# Altium schematic sheet tourellesCommande.SchDoc: Commande
size A4
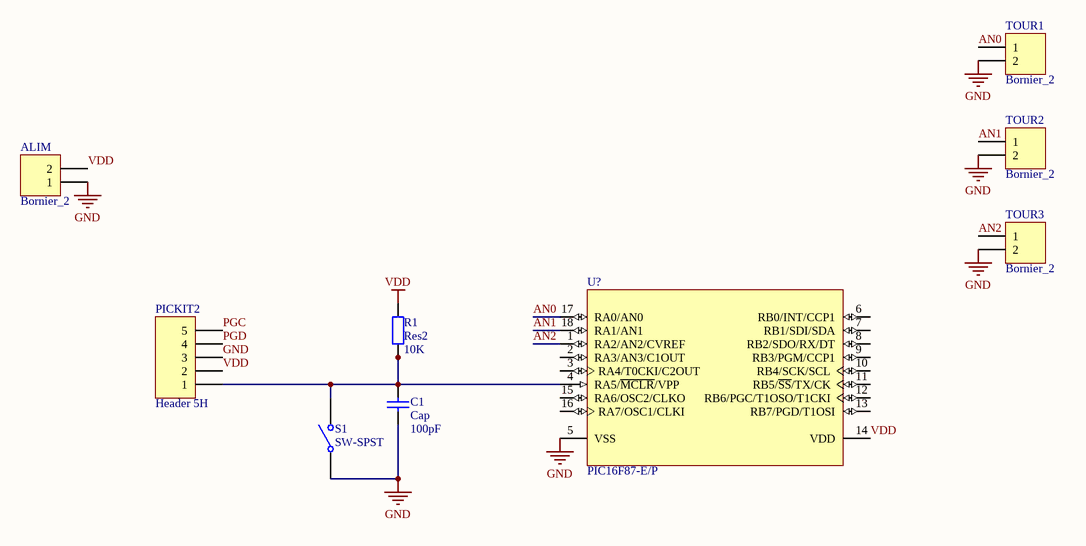
[diagram p0: tourellesCommande.SchDoc]

## Parts
ALIM  Bornier_2  [Bornier_2]
C1  Cap  value 100pF  [RAD-0.3]
PICKIT2  Header 5H  [HDR1X5]
R1  Res2  value 10K  [AXIAL-0.4]
S1  SW-SPST  [SPST-2]
TOUR1  Bornier_2  [Bornier_2]
TOUR2  Bornier_2  [Bornier_2]
TOUR3  Bornier_2  [Bornier_2]
U?  PIC16F87-E/P  [PDIP300-18]

## Nets
GND: ALIM.1 C1.1 PICKIT2.3 S1.1(COMMON) TOUR1.2 TOUR2.2 TOUR3.2 U?.5(VSS)
VDD: ALIM.2 PICKIT2.2 R1.2 U?.14(VDD)
AN0: TOUR1.1 U?.17(RA0/AN0)
AN1: TOUR2.1 U?.18(RA1/AN1)
AN2: TOUR3.1 U?.1(RA2/AN2/CVREF)
PGC: PICKIT2.5
PGD: PICKIT2.4
NetC1_2: C1.2 PICKIT2.1 R1.1 S1.2(NO) U?.4(RA5/~{MCLR}/VPP)

Not connected (* = marked no-connect by the designer): U? 2(RA3/AN3/C1OUT) 3(RA4/T0CKI/C2OUT) 6(RB0/INT/CCP1) 7(RB1/SDI/SDA) 8(RB2/SDO/RX/DT) 9(RB3/PGM/CCP1) 10(RB4/SCK/SCL) 11(RB5/~{SS}/TX/CK) 12(RB6/PGC/T1OSO/T1CKI) 13(RB7/PGD/T1OSI) 15(RA6/OSC2/CLKO) 16(RA7/OSC1/CLKI)

## Notes on the sheet
- Title :
- Size:
- A4
- Date:
- Time:
- File:

## Library data of the parts
ALIM TOUR1-TOUR3 = Bornier_2: Header, 2-Pin; LatestRevisionDate: 17-Jul-2002; LatestRevisionNote: Re-released for DXP Platform.; Publisher: Altium Limited
C1 = Cap: Capacitor; Published: 8-Jun-2000; LatestRevisionDate: 17-Jul-2002; LatestRevisionNote: Re-released for DXP Platform.; PackageReference: RAD-0.3; Publisher: Altium Limited; PackageDescription: Radial Cap, Thru-Hole; 2 Leads; 0.3 in Pin Spacing
PICKIT2 = Header 5H: Header, 5-Pin, Right Angle; LatestRevisionDate: 17-Jul-2002; LatestRevisionNote: Re-released for DXP Platform.; Publisher: Altium Limited
R1 = Res2: Resistor; Published: 8-Jun-2000; LatestRevisionDate: 17-Jul-2002; LatestRevisionNote: Re-released for DXP Platform.; PackageReference: AXIAL-0.4; Publisher: Altium Limited; PackageDescription: Axial Device, Thru-Hole; 2 Leads; 0.4 in Pin Spacing
S1 = SW-SPST: Single-Pole, Single-Throw Switch; Published: 24-Mar-1999; LatestRevisionDate: 17-Jul-2002; LatestRevisionNote: Re-released for DXP Platform.; PackageReference: SPST-2; Publisher: Altium Limited; PackageDescription: Switch; 2 Leads
U? = PIC16F87-E/P: Enhanced FLASH Microcontroller with nanoWatt Technology, 4K (x14-Bit words) FLASH, 368 Bytes RAM, 18-Pin PDIP, Standard VDD Range, Extended Temperature; PackageDocument: 2003; Note: 25mA source/sink per I/O.; Note: The CCP1 pin is determined by CCPMX in Configuration Word 1 register.; Published: 11-Oct-2004; LatestRevisionDate: 4-Mar-2005; LatestRevisionNote: Stylized 3D Model Added.; DatasheetDocument: DS30487B_2003; PackageReference: PDIP300-18; Publisher: Altium Limited; Code_JEDEC: MS-001; ComponentLink1Description: Manufacturer Link; ComponentLink1URL: http://www.microchip.com/index.asp; ComponentLink2Description: Datasheet; ComponentLink2URL: http://ww1.microchip.com/downloads/en/DeviceDoc/30487b.pdf; ComponentLink3Description: Packaging Specification; ComponentLink3URL: http://ww1.microchip.com/downloads/en/PackagingSpec/00049AD.pdf